# Altium schematic sheet Sheet11111111.SchDoc
size A
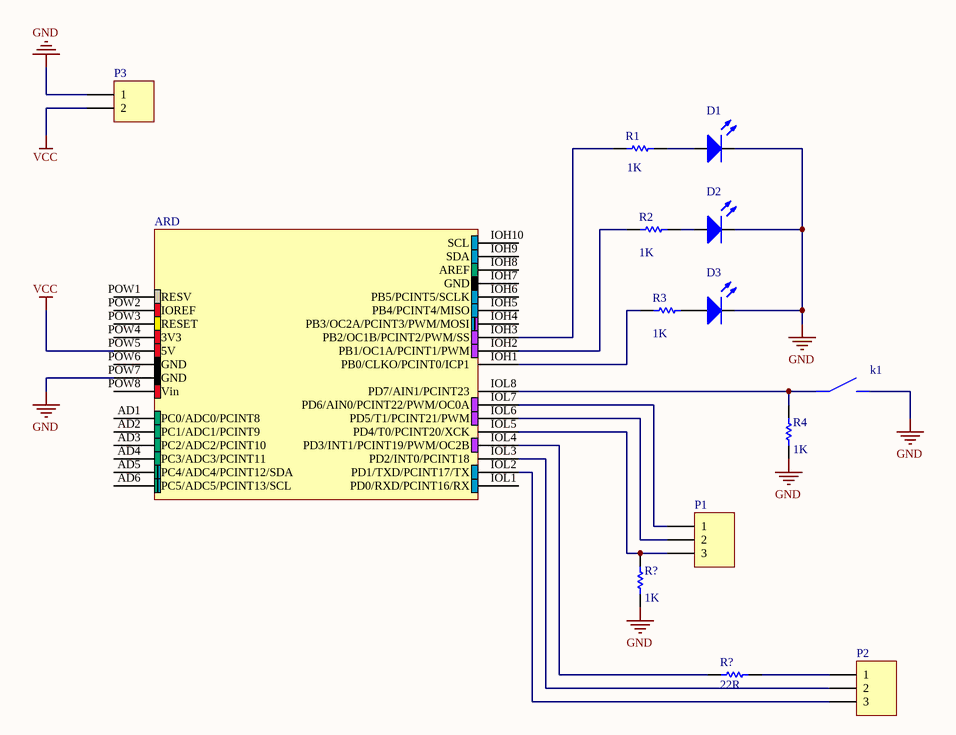
[diagram p0: Sheet11111111.SchDoc]

## Parts
(Parts that share a designator on the sheet are numbered #1, #2 ... from top to bottom, then left to right.)
ARD  Arduino uno  [ARDUINO_UNO]  (value not drawn)
D1  LED  [LED_5mm]  (value not drawn)
D2  LED  [LED_5mm]  (value not drawn)
D3  LED  [LED_5mm]  (value not drawn)
k1  k  [LTL613]  (value not drawn)
P1  Header  [HDR1X3H]  (value not drawn)
P2  Header  [HDR1X3H]  (value not drawn)
P3  Header 2H  [HDR1X2H]  (value not drawn)
R1  value 1K  [AXIAL-0.3]  (hidden comment: Res1)
R2  value 1K  [AXIAL-0.3]  (hidden comment: Res1)
R3  value 1K  [AXIAL-0.3]  (hidden comment: Res1)
R4  value 1K  [AXIAL-0.3]  (hidden comment: Res1)
R?#1  value 1K  [AXIAL-0.3]  (hidden comment: Res1)
R?#2  value 22R  [AXIAL-0.3]  (hidden comment: Res1)

## Nets
GND: ARD.POW7(GND) D1.K D2.K D3.K k1.1 P3.1 R4.1 R?#1.1
VCC: ARD.POW5(5V) P3.2
NetARD_IOH1: ARD.IOH1(PB0/CLKO/PCINT0/ICP1) R3.2
NetARD_IOH2: ARD.IOH2(PB1/OC1A/PCINT1/PWM) R2.2
NetARD_IOH3: ARD.IOH3(PB2/OC1B/PCINT2/PWM/SS) R1.2
NetARD_IOL2: ARD.IOL2(PD1/TXD/PCINT17/TX) P2.3
NetARD_IOL3: ARD.IOL3(PD2/INT0/PCINT18) P2.2
NetARD_IOL4: ARD.IOL4(PD3/INT1/PCINT19/PWM/OC2B) R?#2.2
NetARD_IOL5: ARD.IOL5(PD4/T0/PCINT20/XCK) P1.3 R?#1.2
NetARD_IOL6: ARD.IOL6(PD5/T1/PCINT21/PWM) P1.2
NetARD_IOL7: ARD.IOL7(PD6/AIN0/PCINT22/PWM/OC0A) P1.1
NetARD_IOL8: ARD.IOL8(PD7/AIN1/PCINT23) k1.0 R4.2
NetD1_A: D1.A R1.1
NetD2_A: D2.A R2.1
NetD3_A: D3.A R3.1
NetP2_1: P2.1 R?#2.1

Not connected (* = marked no-connect by the designer): ARD AD1(PC0/ADC0/PCINT8) AD2(PC1/ADC1/PCINT9) AD3(PC2/ADC2/PCINT10) AD4(PC3/ADC3/PCINT11) AD5(PC4/ADC4/PCINT12/SDA) AD6(PC5/ADC5/PCINT13/SCL) IOH4(PB3/OC2A/PCINT3/PWM/MOSI) IOH5(PB4/PCINT4/MISO) IOH6(PB5/PCINT5/SCLK) IOH7(GND) IOH8(AREF) IOH9(SDA) IOH10(SCL) IOL1(PD0/RXD/PCINT16/RX) POW1(RESV) POW2(IOREF) POW3(RESET) POW4(3V3) POW6(GND) POW8(Vin)

## Library data of the parts
ARD = Arduino uno: Arduino UNO Connector
D1-D3 = LED: Typical INFRARED GaAs LED
k1 = Button_tact: Tact button switch
P1 P2 = Header 3H: Header, 3-Pin, Right Angle; LatestRevisionDate: 17-Jul-2002; LatestRevisionNote: Re-released for DXP Platform.; Publisher: Altium Limited
P3 = Header 2H: Header, 2-Pin, Right Angle; LatestRevisionDate: 17-Jul-2002; LatestRevisionNote: Re-released for DXP Platform.; Publisher: Altium Limited
R1-R4 R?#1 R?#2 = Res1: Resistor; Published: 8-Jun-2000; LatestRevisionDate: 17-Jul-2002; LatestRevisionNote: Re-released for DXP Platform.; PackageReference: AXIAL-0.3; Publisher: Altium Limited; PackageDescription: Axial Device, Thru-Hole; 2 Leads; 0.3 in Pin Spacing